# Altium project SmartHaloV1.PrjPcb (part 2 of 2)

## Sheet 5_SENSORS.SchDoc: SmartHalo V1.0 Rev1 - Sensors
size B; Author: Sébastien Gélinas; Organization: CycleLabs Solutions Inc.; Address1: 5445 de Gaspé; Address2: Montréal, QC; Address3: Canada; Address4: H2T 3B2; DocumentNumber: 2; Revision: 1; SheetNumber: 5; SheetTotal: 8
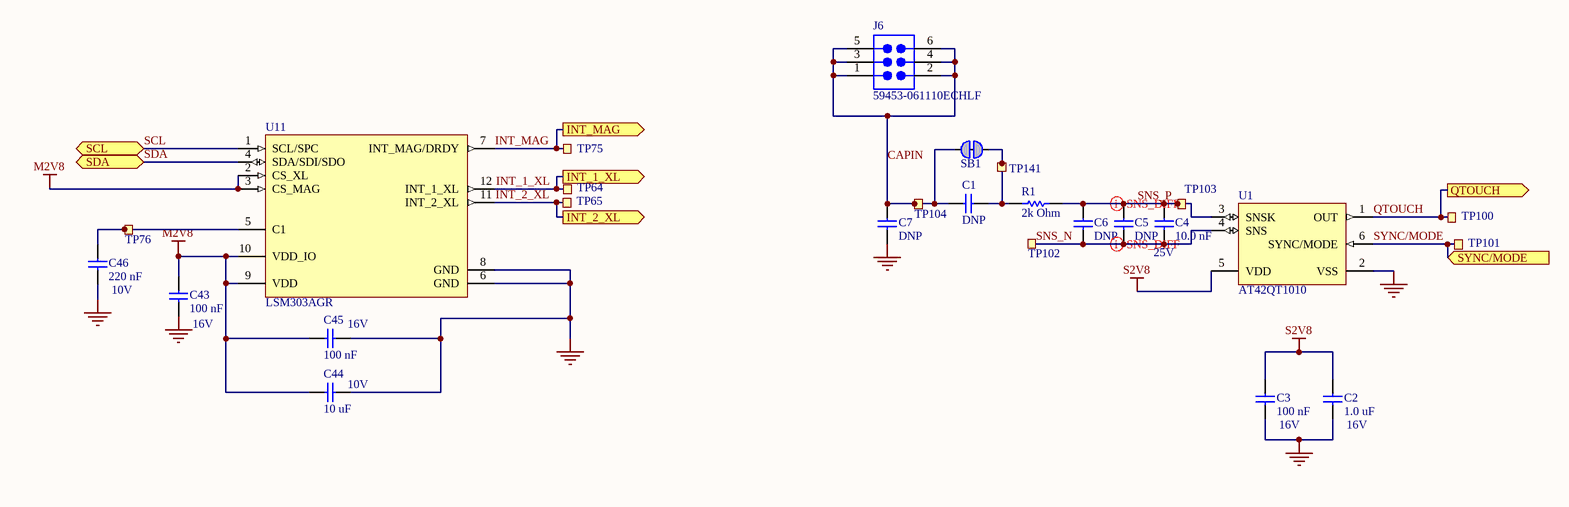
[diagram p4: 5_SENSORS.SchDoc]

### Parts
C1  DNP  [Varitron_CAP0402]  (no BOM)
C2  1.0 uF  Voltage Rating: 16V  [Varitron_CAP0603]
C3  100 nF  Voltage Rating: 16V  [Varitron_CAP0402]
C4  10.0 nF  Voltage Rating: 25V  [Varitron_CAP0402]
C5  DNP  [Varitron_CAP0402]  (no BOM)
C6  DNP  [Varitron_CAP0402]  (no BOM)
C7  DNP  [Varitron_CAP0402]  (no BOM)
C43  100 nF  Voltage Rating: 16V  [Varitron_CAP0402]
C44  10 uF  Voltage Rating: 10V  [Varitron_CAP0805]
C45  100 nF  Voltage Rating: 16V  [Varitron_CAP0402]
C46  220 nF  Voltage Rating: 10V  [Varitron_CAP0402]
J6  59453-061110ECHLF  [59453061110ECHLF]
R1  2k Ohm  [Varitron_RES0402]
SB1  Solderbridge  [Solderbridge_Shorted]  (value not drawn)  (net tie, no BOM)
TP64  TP64  [TESTPAD-TH-35mils]  (value not drawn)  (no BOM)
TP65  TP65  [TESTPAD-TH-35mils]  (value not drawn)  (no BOM)
TP75  TP75  [TESTPAD-TH-35mils]  (value not drawn)  (no BOM)
TP76  TP76  [TESTPAD-TH-35mils]  (value not drawn)  (no BOM)
TP100  TP100  [TESTPAD-TH-1_5mm]  (value not drawn)  (no BOM)
TP101  TP101  [TESTPAD-TH-35mils]  (value not drawn)  (no BOM)
TP102  TP102  [TESTPAD-TH-35mils]  (value not drawn)  (no BOM)
TP103  TP103  [TESTPAD-TH-35mils]  (value not drawn)  (no BOM)
TP104  TP104  [TESTPAD-TH-35mils]  (value not drawn)  (no BOM)
TP141  TP141  [TESTPAD-TH-35mils]  (value not drawn)  (no BOM)
U1  AT42QT1010  [6ST1_N]
U11  LSM303AGR  [LGA12-2X2X1_N]

### Ports
INT_1_XL (out), INT_2_XL (out), INT_MAG (out), QTOUCH (out), SCL (bidir), SDA (bidir), SYNC/MODE (in)

### Nets
GND: C2.2 C3.2 C7.2 C43.2 C44.2 C45.2 C46.2 J6.0(ASSY) U1.2(VSS) U11.6(GND) U11.8(GND)
M2V8: C43.1 C44.1 C45.1 U11.2(CS_XL) U11.3(CS_MAG) U11.9(VDD) U11.10(VDD_IO)  [project net VDD_nRF]
S2V8: C2.1 C3.1 U1.5(VDD)
CAPIN: C1.1 C7.1 J6.1 J6.2 J6.3 J6.4 J6.5 J6.6 SB1.2 TP104.1
INT_1_XL: TP64.1 U11.12(INT_1_XL) ; port INT_1_XL
INT_2_XL: TP65.1 U11.11(INT_2_XL) ; port INT_2_XL
INT_MAG: TP75.1 U11.7(INT_MAG/DRDY) ; port INT_MAG
QTOUCH: TP100.1 U1.1(OUT) ; port QTOUCH
SCL: U11.1(SCL/SPC) ; port SCL
SDA: U11.4(SDA/SDI/SDO) ; port SDA
SNS_N: C4.2 C5.2 C6.2 TP102.1 U1.4(SNS)
SNS_P: C4.1 C5.1 C6.1 R1.1 TP103.1 U1.3(SNSK)
SYNC/MODE: TP101.1 U1.6(SYNC/MODE) ; port SYNC/MODE
NetC1_2: C1.2 R1.2 SB1.1 TP141.1
NetC46_1: C46.1 TP76.1 U11.5(C1)

### Layout directives
differential pair: SNS_N, SNS_P

### Notes on the sheet
- Title
- Size:
- Date:
- B
- Author:
- Time:
- Sheet
- Revision:
- of
- File:

### Library data of the parts
C1 C5-C7 = Varitron_CAP0402: C nF V TEMP TOL% 0402 (1005 Metric)  SMD; Case-EIA: 0402; Case-Metric: 1005; Tolerance: TOL; Value: C nF; Final: Y; Technology: SMT; Footprint Name: 0402; Supplier: Arrow Electronics
C2 = Varitron_CAP0603: as C50 on sheet 2_PWR; Tolerance: 10%; Technology: SMT; Temperature Coefficient: X7R; Part Number: CL10B105KO8NNNC; Value: 1.0 uF; Supplier: Arrow Electronics; Footprint Name: 0603
C3 C43 C45 = Varitron_CAP0402: as C51 on sheet 2_PWR; Tolerance: 10%; Technology: SMT; Temperature Coefficient: X7R; Part Number: CL05B104KO5NNNC; Value: 100 nF; Supplier: Arrow Electronics; Footprint Name: 0402
C4 = Varitron_CAP0402: 10.0 nF 25V X7R 5% 0402 (1005 Metric)  SMD; Manufacturer: Yageo; Manufacturer Part Number: CC0402JRX7R8BB103; SmartHalo Part Number: 630004-01; Case-EIA: 0402; Case-Metric: 1005; Final: Y; Tolerance: 5%; Technology: SMT; Temperature Coefficient: X7R; Part Number: CC0402JRX7R8BB103; Value: 10.0 nF; Footprint Name: 0402; Supplier: Arrow Electronics
C44 = Varitron_CAP0805: 10 uF 10V X7R 10% 0805 (2012 Metric)  SMD; Manufacturer: Samsung; Manufacturer Part Number: CL21B106KPQNNNE; SmartHalo Part Number: 630013-01; Case-EIA: 0805; Case-Metric: 2012; Final: Y; Tolerance: 10%; Technology: SMT; Temperature Coefficient: X7R; Part Number: CL21B106KPQNNNE; Value: 10 uF; Supplier: Arrow Electronics; Footprint Name: 0805
C46 = Varitron_CAP0402: 220 nF 10V X7R 10% 0402 (1005 Metric)  SMD; Manufacturer: Samsung; Manufacturer Part Number: CL05B224KP5NNNC; SmartHalo Part Number: 630014-01; Case-EIA: 0402; Case-Metric: 1005; Final: Y; Tolerance: 10%; Technology: SMT; Temperature Coefficient: X7R; Part Number: CL05B224KP5NNNC; Value: 220 nF; Supplier: Arrow Electronics; Footprint Name: 0402
J6 = 59453-061110ECHLF: Connector, FPC, 0.5 mm pitch, 6 contacts; Manufacturer: FCI; SmartHalo Part Number: 630023-01; Final: Y; Manufacturer Part Number: 59453-061110ECHLF; Part Number: 59453-061110ECHLF; Footprint Name: CUSTOM(FPC Connector); Supplier: Arrow Electronics
R1 = Varitron_RES0402: 2k 0.063W 5%  0402 (1005 Metric)  SMD; Manufacturer: Samsung; Manufacturer Part Number: RC1005J202CS; SmartHalo Part Number: 630033-01; Case-Metric: 1005; Case-EIA: 0402; Final: Y; Tolerance: 5%; Technology: SMT; Power: 0.063W; Part Number: RC1005J202CS; Value: 2k Ohm; Footprint Name: 0402; Supplier: Arrow Electronics
SB1 = SOLDERBRIDGE_SHORTED: Shorted Solderbridge; Value: Solderbridge
TP64 TP65 TP75 TP76 TP101-TP104 TP141 = TESTPAD_TH_35mils: as TP1 on sheet 2_PWR
TP100 = TESTPAD_TH_1_5MM: as TP2 on sheet 2_PWR
U1 = AT42QT1010: One-channel Touch Sensor IC with Reset Timer, -40° to +85° C, 6-pin SOT23; Manufacturer: Atmel; SmartHalo Part Number: 630051-01; Final: Y; Manufacturer Part Number: AT42QT1010; Part Number: AT42QT1010; Footprint Name: SOT23-6; Supplier: Arrow Electronics
U11 = LSM303AGR: IC 3D Accelerometer and 3D Magnetometer, LGA-12, 2 x 2 x 1 mm; Manufacturer: STMicroelectronics; SmartHalo Part Number: 630059-01; Final: Y; Manufacturer Part Number: LSM303AGR; Footprint Name: LGA12; Part Number: LSM303AGR; Supplier: Arrow Electronics

## Sheet 6_MISC.SchDoc: SmartHalo V1.0 Rev1 - Misc
size B; Author: Sébastien Gélinas; Organization: CycleLabs Solutions Inc.; Address1: 5445 de Gaspé; Address2: Montréal, QC; Address3: Canada; Address4: H2T 3B2; Revision: 1; SheetNumber: 6; SheetTotal: 8
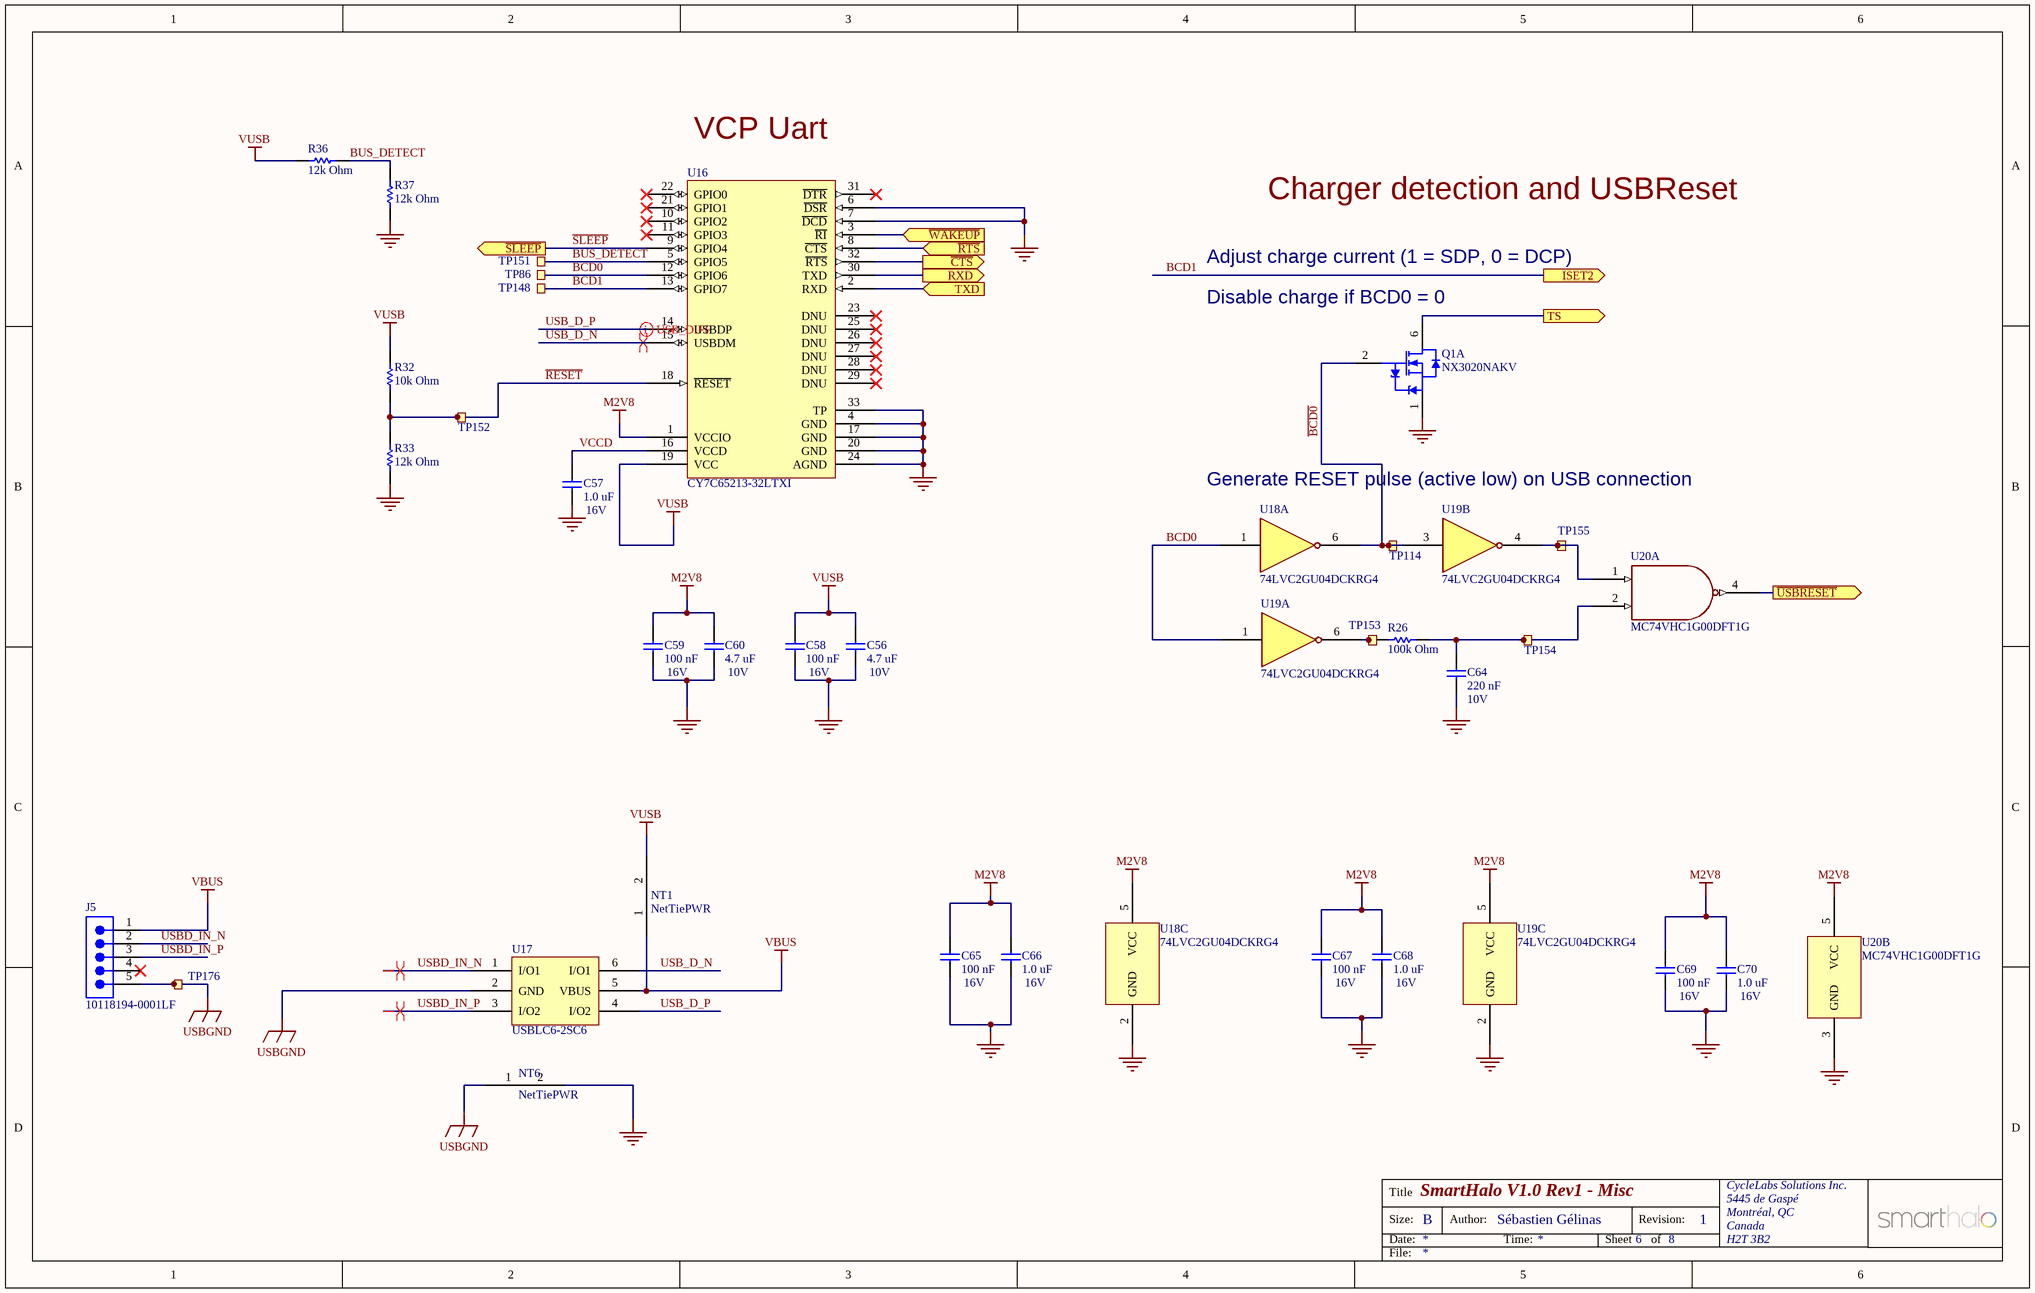
[diagram p5: 6_MISC.SchDoc]

### Parts
C56  4.7 uF  Voltage Rating: 10V  [Varitron_CAP0603]
C57  1.0 uF  Voltage Rating: 16V  [Varitron_CAP0603]
C58  100 nF  Voltage Rating: 16V  [Varitron_CAP0402]
C59  100 nF  Voltage Rating: 16V  [Varitron_CAP0402]
C60  4.7 uF  Voltage Rating: 10V  [Varitron_CAP0603]
C64  220 nF  Voltage Rating: 10V  [Varitron_CAP0402]
C65  100 nF  Voltage Rating: 16V  [Varitron_CAP0402]
C66  1.0 uF  Voltage Rating: 16V  [Varitron_CAP0603]
C67  100 nF  Voltage Rating: 16V  [Varitron_CAP0402]
C68  1.0 uF  Voltage Rating: 16V  [Varitron_CAP0603]
C69  100 nF  Voltage Rating: 16V  [Varitron_CAP0402]
C70  1.0 uF  Voltage Rating: 16V  [Varitron_CAP0603]
J5  10118194-0001LF  [10118194-0001LF]
NT1  NetTiePWR  [NetTiePWR]  (net tie, no BOM)
NT6  NetTiePWR  [NetTiePWR]  (net tie, no BOM)
Q1  NX3020NAKV  [SOT666]  (part A of 2)
R26  100k Ohm  [Varitron_RES0402]
R32  10k Ohm  [Varitron_RES0402]
R33  12k Ohm  [Varitron_RES0402]
R36  12k Ohm  [Varitron_RES0402]
R37  12k Ohm  [Varitron_RES0402]
TP86  TP86  [TESTPAD-TH-35mils]  (value not drawn)  (no BOM)
TP114  TP114  [TESTPAD-TH-35mils]  (value not drawn)  (no BOM)
TP148  TP148  [TESTPAD-TH-35mils]  (value not drawn)  (no BOM)
TP151  TP151  [TESTPAD-TH-35mils]  (value not drawn)  (no BOM)
TP152  TP152  [TESTPAD-TH-35mils]  (value not drawn)  (no BOM)
TP153  TP153  [TESTPAD-TH-35mils]  (value not drawn)  (no BOM)
TP154  TP154  [TESTPAD-TH-35mils]  (value not drawn)  (no BOM)
TP155  TP155  [TESTPAD-TH-35mils]  (value not drawn)  (no BOM)
TP176  TP176  [TESTPAD-TH-35mils]  (value not drawn)  (no BOM)
U16  CY7C65213-32LTXI  [QFN-32-TP]
U17  USBLC6-2SC6  [ST-SOT23-6]
U18  74LVC2GU04DCKRG4  [SOT363_SC70_6]  (parts A,C of 3)
U19  74LVC2GU04DCKRG4  [SOT363_SC70_6]  (parts A,B,C of 3)
U20  MC74VHC1G00DFT1G  [SC70-5]  (parts A,B of 2)

### Ports
ISET2 (out), RXD (out), TS (out), TXD (in), ~{CTS} (out), ~{RTS} (in), ~{SLEEP} (out), ~{USBRESET} (out), ~{WAKEUP} (in)

### Nets
GND: C56.2 C57.2 C58.2 C59.2 C60.2 C64.1 C65.2 C66.2 C67.2 C68.2 C69.2 C70.2 NT6.2(NET2) Q1.1(S1) R33.1 R37.2 U16.4(GND) U16.6(~{DSR}) U16.7(~{DCD}) U16.17(GND) U16.20(GND) U16.24(AGND) U16.33(TP) U18.2(GND) U19.2(GND) U20.3(GND)
M2V8: C59.1 C60.1 C65.1 C66.1 C67.1 C68.1 C69.1 C70.1 U16.1(VCCIO) U18.5(VCC) U19.5(VCC) U20.5(VCC)  [project net VDD_nRF]
USBGND: J5.0(ASSY) J5.5 NT6.1(NET1) TP176.1 U17.2(GND)
VBUS: J5.1 NT1.1(NET1) U17.5(VBUS)
VUSB: C56.1 C58.1 NT1.2(NET2) R32.2 R36.2 U16.19(VCC)
~{BCD0}: Q1.2(G1) TP114.1 U18.6 U19.3
BCD0: TP86.1 U16.12(GPIO6) U18.1 U19.1
BCD1: TP148.1 U16.13(GPIO7) ; port ISET2
BUS_DETECT: R36.1 R37.1 TP151.1 U16.5(GPIO5)
CTS: U16.32(~{RTS}) ; port ~{CTS}
~{RESET}: R32.1 R33.2 TP152.1 U16.18(~{RESET})
RTS: U16.8(~{CTS}) ; port ~{RTS}
RXD: U16.30(TXD) ; port RXD
~{SLEEP}: U16.9(GPIO4) ; port ~{SLEEP}
TS: Q1.6(D1) ; port TS
TXD: U16.2(RXD) ; port TXD
~{USBRESET}: U20.4 ; port ~{USBRESET}
USB_D_N: U16.15(USBDM) U17.6(I/O1)
USB_D_P: U16.14(USBDP) U17.4(I/O2)
USBD_IN_N: J5.2 U17.1(I/O1)
USBD_IN_P: J5.3 U17.3(I/O2)
VCCD: C57.1 U16.16(VCCD)
~{WAKEUP}: U16.3(~{RI}) ; port ~{WAKEUP}
NetC64_2: C64.2 R26.1 TP154.1 U20.2
NetR26_2: R26.2 TP153.1 U19.6
NetTP155_1: TP155.1 U19.4 U20.1

Not connected (* = marked no-connect by the designer): J5 4*; U16 10(GPIO2)* 11(GPIO3)* 21(GPIO1)* 22(GPIO0)* 23(DNU)* 25(DNU)* 26(DNU)* 27(DNU)* 28(DNU)* 29(DNU)* 31(~{DTR})*

### Layout directives
differential pair: USB_D_N, USB_D_P, USBD_IN_N, USBD_IN_P

### Notes on the sheet
- (near U16) VCP Uart
- Charger detection and USBReset
- Adjust charge current (1 = SDP, 0 = DCP)
- (near Q1) Disable charge if BCD0 = 0
- Generate RESET pulse (active low) on USB connection
- Title
- Size:
- Date:
- B
- Author:
- Time:
- Sheet
- Revision:
- of
- File:

### Library data of the parts
C56 C60 = Varitron_CAP0603: 4.7 uF 10V X5R 10% 0603 (1608 Metric)  SMD; Manufacturer: Yageo; Manufacturer Part Number: CC0603KRX5R6BB475; SmartHalo Part Number: 630009-01; Case-EIA: 0603; Case-Metric: 1608; Final: Y; Tolerance: 10%; Technology: SMT; Temperature Coefficient: X5R; Part Number: CC0603KRX5R6BB475; Value: 4.7 uF; Supplier: Arrow Electronics; Footprint Name: 0603
C57 C66 C68 C70 = Varitron_CAP0603: as C50 on sheet 2_PWR; Tolerance: 10%; Technology: SMT; Temperature Coefficient: X7R; Part Number: CL10B105KO8NNNC; Value: 1.0 uF; Supplier: Arrow Electronics; Footprint Name: 0603
C58 C59 C65 C67 C69 = Varitron_CAP0402: as C51 on sheet 2_PWR; Tolerance: 10%; Technology: SMT; Temperature Coefficient: X7R; Part Number: CL05B104KO5NNNC; Value: 100 nF; Supplier: Arrow Electronics; Footprint Name: 0402
C64 = Varitron_CAP0402: as C46 on sheet 5_SENSORS; Tolerance: 10%; Technology: SMT; Temperature Coefficient: X7R; Part Number: CL05B224KP5NNNC; Supplier: Arrow Electronics; Footprint Name: 0402; Value: 220 nF
J5 = 10118194-0001LF: Micro USB B Type Receptacle; Manufacturer: Amphenol FCI; SmartHalo Part Number: 630022-01; Final: Y; Manufacturer Part Number: 10118194-0001LF; Part Number: 10118194-0001LF; Footprint Name: CUSTOM(Micro USB connector); Supplier: Arrow Electronics; Supplier Part Number: *
Q1 = NX3020NAKV: 30 V, 200 mA dual N-channel Trench MOSFET; Manufacturer: NXP Semiconductors; SmartHalo Part Number: 630030-01; Final: Y; Manufacturer Part Number: NX3020NAKV; Part Number: NX3020NAKV; Footprint Name: SOT666; Supplier: Arrow Electronics
R26 = Varitron_RES0402: 100k 0.063W 5%  0402 (1005 Metric)  SMD; Manufacturer: Samsung; Manufacturer Part Number: RC1005J104CS; SmartHalo Part Number: 630036-01; Case-Metric: 1005; Case-EIA: 0402; Final: Y; Tolerance: 5%; Technology: SMT; Power: 0.063W; Part Number: RC1005J104CS; Supplier: Arrow Electronics; Footprint Name: 0402; Value: 100k Ohm
R32 = Varitron_RES0402: as R19 on sheet 2_PWR; Tolerance: 5%; Technology: SMT; Power: 0.063W; Part Number: RC1005J103CS; Value: 10k Ohm; Footprint Name: 0402; Supplier: Arrow Electronics
R33 R36 R37 = Varitron_RES0402: 12k 0.063W 5%  0402 (1005 Metric)  SMD; Manufacturer: Samsung; Manufacturer Part Number: RC1005J123CS; SmartHalo Part Number: 630047-01; Case-Metric: 1005; Case-EIA: 0402; Final: Y; Tolerance: 5%; Technology: SMT; Power: 0.063W; Part Number: RC1005J123CS; Value: 12k Ohm; Footprint Name: 0402; Supplier: Arrow Electronics
TP86 TP114 TP148 TP151-TP155 TP176 = TESTPAD_TH_35mils: as TP1 on sheet 2_PWR
U16 = CY7C65213-32LTXI: IC USB TO UART BRIDGE 32QFN; Manufacturer: Cypress; SmartHalo Part Number: 630063-01; Final: Y; Manufacturer Part Number: CY7C65213-32LTXI; Part Number: CY7C65213-32LTXI; Footprint Name: QFN32TP; Supplier: Arrow Electronics
U17 = USBLC6-2SC6: Very low capacitance ESD protection; Manufacturer: STMicroelectronics; SmartHalo Part Number: 630064-01; Manufacturer Part Number: USBLC6-2SC6; Part Number: USBLC6-2SC6; Supplier: Arrow Electronics; Footprint Name: SOT23-6
U18 U19 = 74LVC2GU04DCKRG4: Dual Inverter Gate; Manufacturer: Texas Instruments; SmartHalo Part Number: 630057-01; Final: Y; Manufacturer Part Number: 74LVC2GU04DCKRG4; Part Number: 74LVC2GU04DCKRG4; Supplier: Arrow Electronics; Footprint Name: SOT363
U20 = MC74VHC1G00DFT1G: IC Gate NAND 1 Channel; Manufacturer: ON Semiconductor; SmartHalo Part Number: 630065-01; Final: Y; Part Number: MC74VHC1G00DFT1G; Manufacturer Part Number: MC74VHC1G00DFT1G; Supplier: Arrow Electronics; Footprint Name: SC-70

## Sheet 7_ALARM.SchDoc: SmartHalo V1.0 Rev1 - Alarm (sound)
size B; Author: Sebastien Gelinas; CompanyName: CycleLabs Solutions Inc.; Organization: CycleLabs Solutions Inc.; Address1: 5445 de Gaspé; Address2: Montréal, QC; Address3: Canada; Address4: H2T 3B2; Revision: 1; SheetNumber: 7; SheetTotal: 8
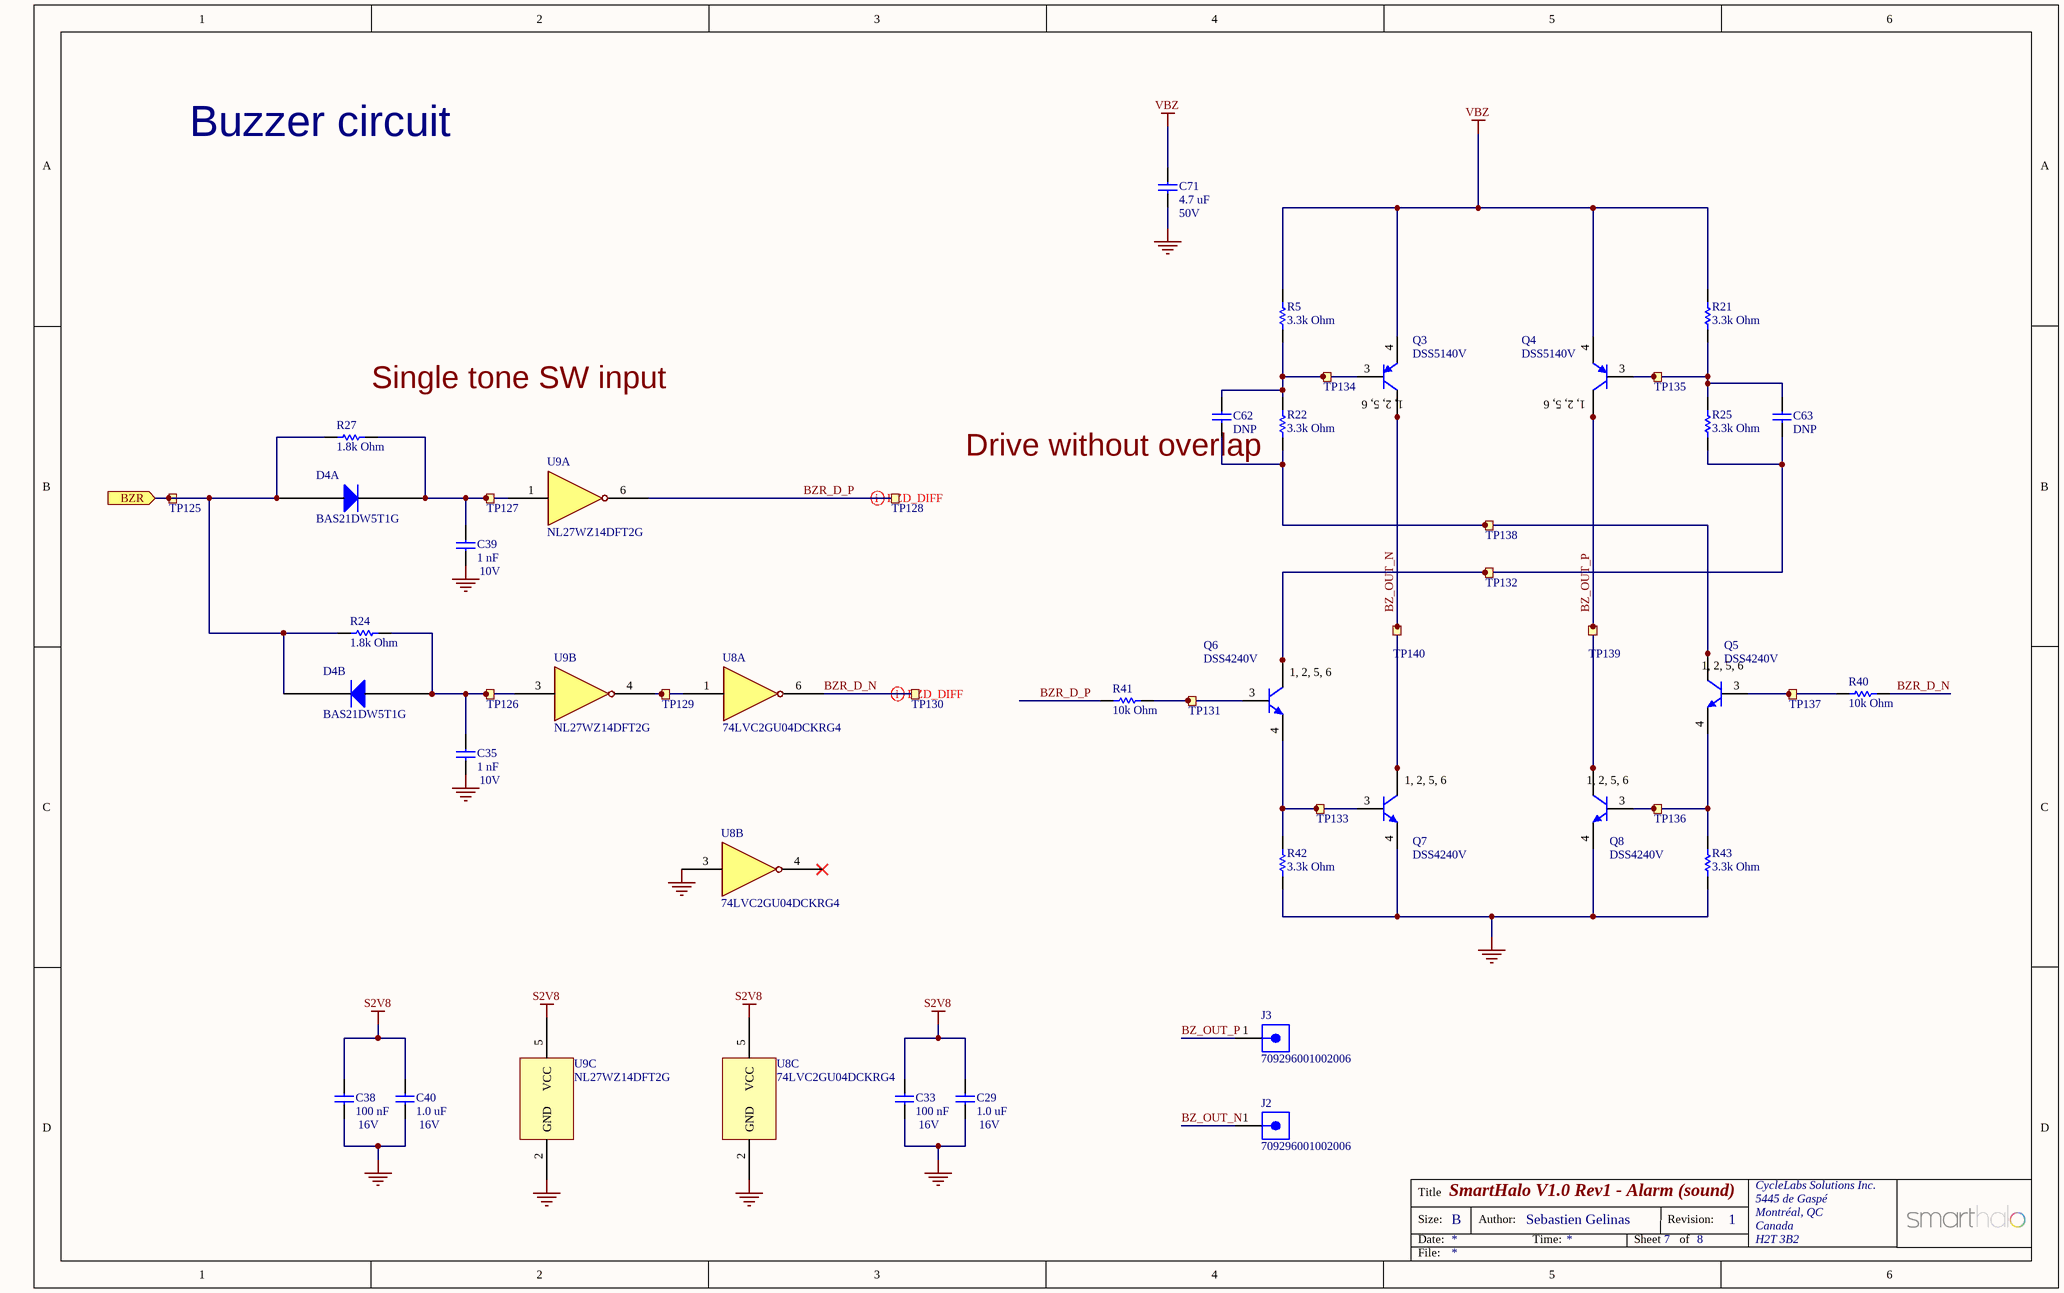
[diagram p6: 7_ALARM.SchDoc]

### Parts
C29  1.0 uF  Voltage Rating: 16V  [Varitron_CAP0603]
C33  100 nF  Voltage Rating: 16V  [Varitron_CAP0402]
C35  1 nF  Voltage Rating: 10V  [Varitron_CAP0402]
C38  100 nF  Voltage Rating: 16V  [Varitron_CAP0402]
C39  1 nF  Voltage Rating: 10V  [Varitron_CAP0402]
C40  1.0 uF  Voltage Rating: 16V  [Varitron_CAP0603]
C62  DNP  [Varitron_CAP0402]  (no BOM)
C63  DNP  [Varitron_CAP0402]  (no BOM)
C71  4.7 uF  Voltage Rating: 50V  [Varitron_CAP0805]
D4  BAS21DW5T1G  [SC70-5]  (parts A,B of 2)
J2  709296001002006  [709296001002006]
J3  709296001002006  [709296001002006]
Q3  DSS5140V  [SOT563]
Q4  DSS5140V  [SOT563]
Q5  DSS4240V  [SOT563]
Q6  DSS4240V  [SOT563]
Q7  DSS4240V  [SOT563]
Q8  DSS4240V  [SOT563]
R5  3.3k Ohm  [Varitron_RES0402]
R21  3.3k Ohm  [Varitron_RES0402]
R22  3.3k Ohm  [Varitron_RES0402]
R24  1.8k Ohm  [Varitron_RES0402]
R25  3.3k Ohm  [Varitron_RES0402]
R27  1.8k Ohm  [Varitron_RES0402]
R40  10k Ohm  [Varitron_RES0402]
R41  10k Ohm  [Varitron_RES0402]
R42  3.3k Ohm  [Varitron_RES0402]
R43  3.3k Ohm  [Varitron_RES0402]
TP125  TP125  [TESTPAD-TH-1_5mm]  (value not drawn)  (no BOM)
TP126  TP126  [TESTPAD-TH-35mils]  (value not drawn)  (no BOM)
TP127  TP127  [TESTPAD-TH-35mils]  (value not drawn)  (no BOM)
TP128  TP128  [TESTPAD-TH-35mils]  (value not drawn)  (no BOM)
TP129  TP129  [TESTPAD-TH-35mils]  (value not drawn)  (no BOM)
TP130  TP130  [TESTPAD-TH-35mils]  (value not drawn)  (no BOM)
TP131  TP131  [TESTPAD-TH-35mils]  (value not drawn)  (no BOM)
TP132  TP132  [TESTPAD-TH-35mils]  (value not drawn)  (no BOM)
TP133  TP133  [TESTPAD-TH-35mils]  (value not drawn)  (no BOM)
TP134  TP134  [TESTPAD-TH-35mils]  (value not drawn)  (no BOM)
TP135  TP135  [TESTPAD-TH-35mils]  (value not drawn)  (no BOM)
TP136  TP136  [TESTPAD-TH-35mils]  (value not drawn)  (no BOM)
TP137  TP137  [TESTPAD-TH-35mils]  (value not drawn)  (no BOM)
TP138  TP138  [TESTPAD-TH-35mils]  (value not drawn)  (no BOM)
TP139  TP139  [TESTPAD-TH-1_5mm]  (value not drawn)  (no BOM)
TP140  TP140  [TESTPAD-TH-1_5mm]  (value not drawn)  (no BOM)
U8  74LVC2GU04DCKRG4  [SOT363_SC70_6]  (parts A,B,C of 3)
U9  NL27WZ14DFT2G  [SOT363_SC70_6]  (parts A,B,C of 3)

### Ports
BZR (in)

### Nets
GND: C29.2 C33.2 C35.2 C38.2 C39.2 C40.2 C71.2 Q7.4(E) Q8.4(E) R42.2 R43.1 U8.2(GND) U8.3 U9.2(GND)
S2V8: C29.1 C33.1 C38.1 C40.1 U8.5(VCC) U9.5(VCC)
VBZ: C71.1 Q3.4(E) Q4.4(E) R5.2 R21.2
BZ_OUT_N: J2.1 Q3.1(C) Q3.2(C) Q3.5(C) Q3.6(C) Q7.1(C) Q7.2(C) Q7.5(C) Q7.6(C) TP140.1
BZ_OUT_P: J3.1 Q4.1(C) Q4.2(C) Q4.5(C) Q4.6(C) Q8.1(C) Q8.2(C) Q8.5(C) Q8.6(C) TP139.1
BZR: D4.1(Anode) D4.4(Cathode) R24.2 R27.2 TP125.1 ; port BZR
BZR_D_N: R40.2 TP130.1 U8.6
BZR_D_P: R41.2 TP128.1 U9.6
NetC35_1: C35.1 D4.3(Anode) R24.1 TP126.1 U9.3
NetC39_1: C39.1 D4.5(Cathode) R27.1 TP127.1 U9.1
NetC62_1: C62.1 Q5.1(C) Q5.2(C) Q5.5(C) Q5.6(C) R22.1 TP138.1
NetC62_2: C62.2 Q3.3(B) R5.1 R22.2 TP134.1
NetC63_1: C63.1 Q6.1(C) Q6.2(C) Q6.5(C) Q6.6(C) R25.1 TP132.1
NetC63_2: C63.2 Q4.3(B) R21.1 R25.2 TP135.1
NetQ5_3: Q5.3(B) R40.1 TP137.1
NetQ5_4: Q5.4(E) Q8.3(B) R43.2 TP136.1
NetQ6_3: Q6.3(B) R41.1 TP131.1
NetQ6_4: Q6.4(E) Q7.3(B) R42.1 TP133.1
NetTP129_1: TP129.1 U8.1 U9.4

Not connected (* = marked no-connect by the designer): D4 2; U8 4*

### Layout directives
differential pair: BZR_D_N, BZR_D_P

### Notes on the sheet
- Buzzer circuit
- (near R27) Single tone SW input
- Drive without overlap
- Title
- Size:
- Date:
- B
- Author:
- Time:
- Sheet
- Revision:
- of
- File:
- (in symbol DSS4240V) 1, 2, 5, 6
- (in symbol DSS5140V) 1, 2, 5, 6

### Library data of the parts
C29 C40 = Varitron_CAP0603: 1.0 uF 16V X7R 10% 0603 (1608 Metric)  SMD; Manufacturer: Samsung; Manufacturer Part Number: CL10B105KO8NNNC; SmartHalo Part Number: 630002-01; Case-EIA: 0603; Case-Metric: 1608; Final: Y; Tolerance: 10%; Technology: SMT; Temperature Coefficient: X7R; Part Number: CL10B105KO8NNNC; Value: 1.0 uF; Supplier: Arrow Electronics; Footprint Name: 0603
C33 C38 = Varitron_CAP0402: 100 nF 16V X7R 10% 0402 (1005 Metric)  SMD; Manufacturer: Samsung; Manufacturer Part Number: CL05B104KO5NNNC; SmartHalo Part Number: 630003-01; Case-EIA: 0402; Case-Metric: 1005; Final: Y; Tolerance: 10%; Technology: SMT; Temperature Coefficient: X7R; Part Number: CL05B104KO5NNNC; Value: 100 nF; Supplier: Arrow Electronics; Footprint Name: 0402
C35 C39 = Varitron_CAP0402: 1 nF 10V X7R 10% 0402 (1005 Metric)  SMD; Manufacturer: AVX; Manufacturer Part Number: 0402ZC102KAT2A; SmartHalo Part Number: 630012-01; Case-EIA: 0402; Case-Metric: 1005; Final: Y; Tolerance: 10%; Technology: SMT; Temperature Coefficient: X7R; Part Number: 0402ZC102KAT2A; Value: 1 nF; Supplier: Arrow Electronics; Footprint Name: 0402
C62 C63 = Varitron_CAP0402: 220 pF 50V X7R 10% 0402 (1005 Metric)  SMD; Case-EIA: 0402; Case-Metric: 1005; Final: Y; Value: 220 pF; Tolerance: 10%; Technology: SMT; Temperature Coefficient: X7R; Supplier: Arrow Electronics; Footprint Name: 0402; Voltage Rating: 50V
C71 = Varitron_CAP0805: 4.7 uF 50V X5R 10% 0805 (2012 Metric)  SMD; Manufacturer: Samsung; Manufacturer Part Number: CL21A475KBQNNNE; SmartHalo Part Number: 630010-01; Case-EIA: 0805; Case-Metric: 2012; Final: Y; Tolerance: 10%; Technology: SMT; Temperature Coefficient: X5R; Part Number: CL21A475KBQNNNE; Supplier: Arrow Electronics; Footprint Name: 0805; Value: 4.7 uF
D4 = BAS21DW5T1G: High Voltage Switching Diode; Manufacturer: ON Semiconductor; SmartHalo Part Number: 630018-01; Final: Y; Manufacturer Part Number: BAS21DW5T1G; Part Number: BAS21DW5T1G; Footprint Name: SC70-5; Supplier: Arrow Electronics
J2 J3 = 709296001002006: Connector, Single Horizontal Contact, 2 x 2 mm; Manufacturer: AVX; SmartHalo Part Number: 630020-01; Final: Y; Manufacturer Part Number: 709296001002006; Part Number: 709296001002006; Footprint Name: CUSTOM(Wire to board connector); Supplier: Arrow Electronics; Supplier Part Number: *
Q3 Q4 = DSS5140V: PNP SMT Transistor, Low VCESAT; Manufacturer: Diodes Inc.; SmartHalo Part Number: 630031-01; Final: Y; hfe: 300; VBE: -1V; VCESAT: -310 mV; Supplier: Arrow Electronics; Part Number: DSS5140V; Manufacturer Part Number: DSS5140V; Footprint Name: SOT563
Q5-Q8 = DSS4240V: NPN SMT Transistor, Low VCESAT; Manufacturer: Diodes Inc.; SmartHalo Part Number: 630032-01; Final: Y; hfe: 300; VBE: 1.1V; VCESAT: 400 mV; Supplier: Arrow Electronics; Part Number: DSS4240V; Manufacturer Part Number: DSS4240V; Footprint Name: SOT563
R5 = Varitron_RES0402: 3k3 0.063W 5%  0402 (1005 Metric)  SMD; Manufacturer: Samsung; Manufacturer Part Number: RC1005J332CS; SmartHalo Part Number: 630037-01; Case-Metric: 1005; Power: 0.063; Case-EIA: 0402; Final: Y; Tolerance: 5%; Technology: SMT; Part Number: RC1005J332CS; Supplier: Arrow Electronics; Footprint Name: 0402; Value: 3.3k Ohm
R21 R22 R25 R42 R43 = Varitron_RES0402: 3k3 0.063W 5%  0402 (1005 Metric)  SMD; Manufacturer: Samsung; Manufacturer Part Number: RC1005J332CS; SmartHalo Part Number: 630037-01; Case-Metric: 1005; Case-EIA: 0402; Final: Y; Tolerance: 5%; Technology: SMT; Power: 0.063W; Part Number: RC1005J332CS; Supplier: Arrow Electronics; Footprint Name: 0402; Value: 3.3k Ohm
R24 R27 = Varitron_RES0402: 1k8 0.063W 5%  0402 (1005 Metric)  SMD; Manufacturer: Samsung; Manufacturer Part Number: RC1005J182CS; SmartHalo Part Number: 630046-01; Case-Metric: 1005; Case-EIA: 0402; Final: Y; Tolerance: 5%; Technology: SMT; Power: 0.063W; Part Number: RC1005J182CS; Value: 1.8k Ohm; Footprint Name: 0402; Supplier: Arrow Electronics
R40 R41 = Varitron_RES0402: 10k 0.063W 5%  0402 (1005 Metric)  SMD; Manufacturer: Samsung; Manufacturer Part Number: RC1005J103CS; SmartHalo Part Number: 630041-01; Case-Metric: 1005; Case-EIA: 0402; Final: Y; Tolerance: 5%; Technology: SMT; Power: 0.063W; Part Number: RC1005J103CS; Supplier: Arrow Electronics; Footprint Name: 0402; Value: 10k Ohm
TP125 TP139 TP140 = TESTPAD_TH_1_5MM: Testpoint, through hole, 1.5mm; Value: TP
TP126-TP138 = TESTPAD_TH_35mils: Testpoint, through hole, 35 mils; Value: TP
U8 = 74LVC2GU04DCKRG4: Dual Inverter Gate; Manufacturer: Texas Instruments; SmartHalo Part Number: 630057-01; Final: Y; Manufacturer Part Number: 74LVC2GU04DCKRG4; Part Number: 74LVC2GU04DCKRG4; Supplier: Arrow Electronics; Footprint Name: SOT363
U9 = NL27WZ14DFT2G: IC Dual Inverter with Schmitt Trigger Inputs; Manufacturer: ON Semiconductor; SmartHalo Part Number: 630058-01; Final: Y; Manufacturer Part Number: NL27WZ14DFT2G; Part Number: NL27WZ14DFT2G; Footprint Name: SOT363; Supplier: Arrow Electronics

## Sheet 8_LEDS.SchDoc: SmartHalo V1.0 Rev1 - Leds
size B; Author: Sébastien Gélinas; Organization: CycleLabs Solutions Inc.; Address1: 5445 de Gaspé; Address2: Montréal, QC; Address3: Canada; Address4: H2T 3B2; Revision: 1; SheetNumber: 8; SheetTotal: 8
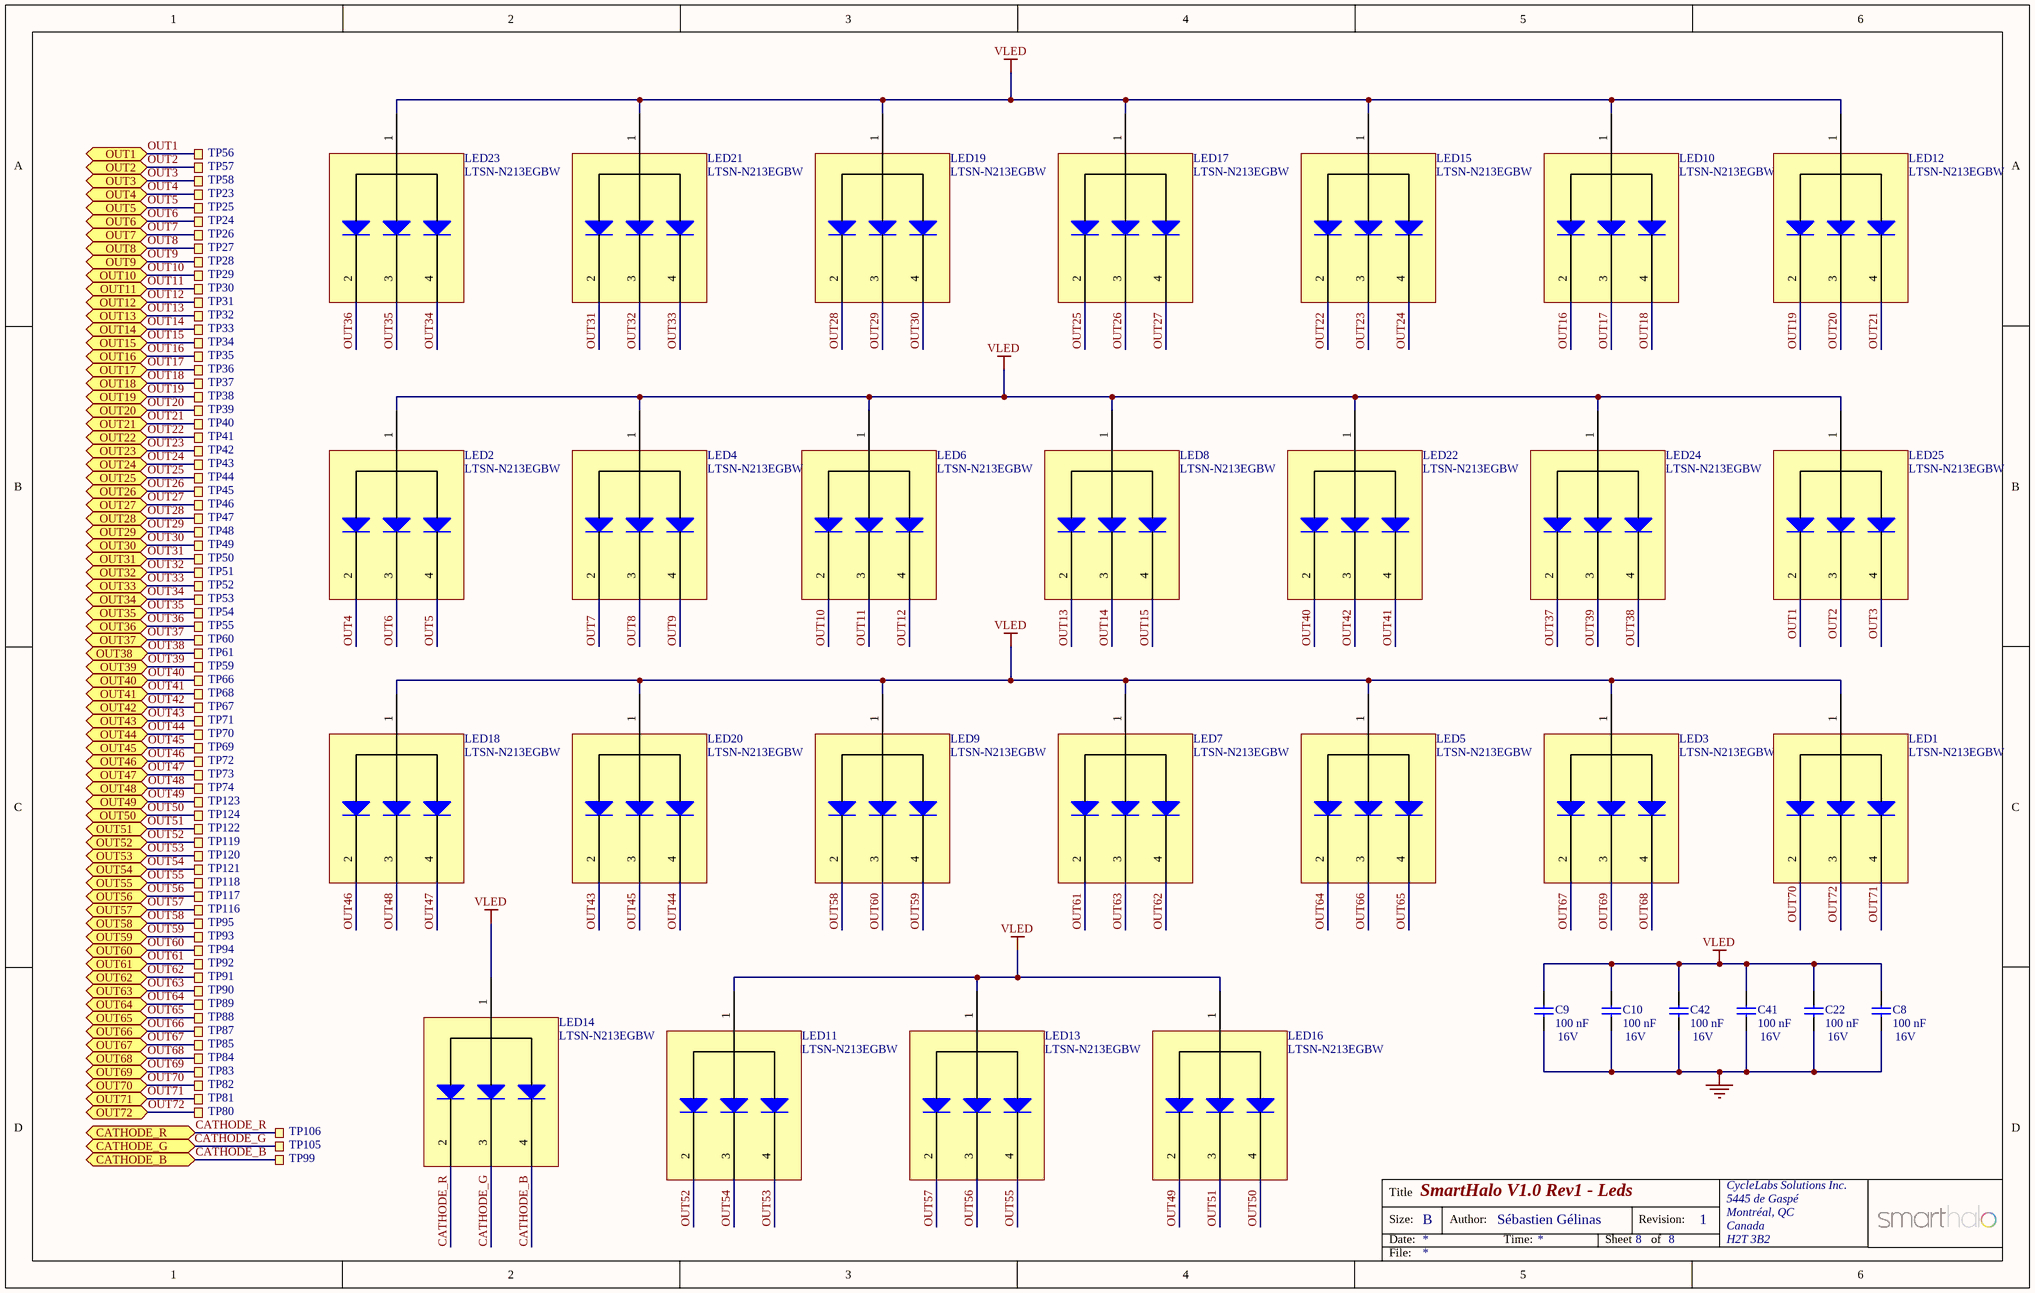
[diagram p7: 8_LEDS.SchDoc]

### Parts
C8  100 nF  Voltage Rating: 16V  [Varitron_CAP0402]
C9  100 nF  Voltage Rating: 16V  [Varitron_CAP0402]
C10  100 nF  Voltage Rating: 16V  [Varitron_CAP0402]
C22  100 nF  Voltage Rating: 16V  [Varitron_CAP0402]
C41  100 nF  Voltage Rating: 16V  [Varitron_CAP0402]
C42  100 nF  Voltage Rating: 16V  [Varitron_CAP0402]
LED1  LTSN-N213EGBW  [LTSN-N213EGBW]
LED2  LTSN-N213EGBW  [LTSN-N213EGBW]
LED3  LTSN-N213EGBW  [LTSN-N213EGBW]
LED4  LTSN-N213EGBW  [LTSN-N213EGBW]
LED5  LTSN-N213EGBW  [LTSN-N213EGBW]
LED6  LTSN-N213EGBW  [LTSN-N213EGBW]
LED7  LTSN-N213EGBW  [LTSN-N213EGBW]
LED8  LTSN-N213EGBW  [LTSN-N213EGBW]
LED9  LTSN-N213EGBW  [LTSN-N213EGBW]
LED10  LTSN-N213EGBW  [LTSN-N213EGBW]
LED11  LTSN-N213EGBW  [LTSN-N213EGBW]
LED12  LTSN-N213EGBW  [LTSN-N213EGBW]
LED13  LTSN-N213EGBW  [LTSN-N213EGBW]
LED14  LTSN-N213EGBW  [LTSN-N213EGBW]
LED15  LTSN-N213EGBW  [LTSN-N213EGBW]
LED16  LTSN-N213EGBW  [LTSN-N213EGBW]
LED17  LTSN-N213EGBW  [LTSN-N213EGBW]
LED18  LTSN-N213EGBW  [LTSN-N213EGBW]
LED19  LTSN-N213EGBW  [LTSN-N213EGBW]
LED20  LTSN-N213EGBW  [LTSN-N213EGBW]
LED21  LTSN-N213EGBW  [LTSN-N213EGBW]
LED22  LTSN-N213EGBW  [LTSN-N213EGBW]
LED23  LTSN-N213EGBW  [LTSN-N213EGBW]
LED24  LTSN-N213EGBW  [LTSN-N213EGBW]
LED25  LTSN-N213EGBW  [LTSN-N213EGBW]
TP23  TP23  [TESTPAD-TH-35mils]  (value not drawn)  (no BOM)
TP24  TP24  [TESTPAD-TH-35mils]  (value not drawn)  (no BOM)
TP25  TP25  [TESTPAD-TH-35mils]  (value not drawn)  (no BOM)
TP26  TP26  [TESTPAD-TH-35mils]  (value not drawn)  (no BOM)
TP27  TP27  [TESTPAD-TH-35mils]  (value not drawn)  (no BOM)
TP28  TP28  [TESTPAD-TH-35mils]  (value not drawn)  (no BOM)
TP29  TP29  [TESTPAD-TH-35mils]  (value not drawn)  (no BOM)
TP30  TP30  [TESTPAD-TH-35mils]  (value not drawn)  (no BOM)
TP31  TP31  [TESTPAD-TH-35mils]  (value not drawn)  (no BOM)
TP32  TP32  [TESTPAD-TH-35mils]  (value not drawn)  (no BOM)
TP33  TP33  [TESTPAD-TH-35mils]  (value not drawn)  (no BOM)
TP34  TP34  [TESTPAD-TH-35mils]  (value not drawn)  (no BOM)
TP35  TP35  [TESTPAD-TH-35mils]  (value not drawn)  (no BOM)
TP36  TP36  [TESTPAD-TH-35mils]  (value not drawn)  (no BOM)
TP37  TP37  [TESTPAD-TH-35mils]  (value not drawn)  (no BOM)
TP38  TP38  [TESTPAD-TH-35mils]  (value not drawn)  (no BOM)
TP39  TP39  [TESTPAD-TH-35mils]  (value not drawn)  (no BOM)
TP40  TP40  [TESTPAD-TH-35mils]  (value not drawn)  (no BOM)
TP41  TP41  [TESTPAD-TH-35mils]  (value not drawn)  (no BOM)
TP42  TP42  [TESTPAD-TH-35mils]  (value not drawn)  (no BOM)
TP43  TP43  [TESTPAD-TH-35mils]  (value not drawn)  (no BOM)
TP44  TP44  [TESTPAD-TH-35mils]  (value not drawn)  (no BOM)
TP45  TP45  [TESTPAD-TH-35mils]  (value not drawn)  (no BOM)
TP46  TP46  [TESTPAD-TH-35mils]  (value not drawn)  (no BOM)
TP47  TP47  [TESTPAD-TH-35mils]  (value not drawn)  (no BOM)
TP48  TP48  [TESTPAD-TH-35mils]  (value not drawn)  (no BOM)
TP49  TP49  [TESTPAD-TH-35mils]  (value not drawn)  (no BOM)
TP50  TP50  [TESTPAD-TH-35mils]  (value not drawn)  (no BOM)
TP51  TP51  [TESTPAD-TH-35mils]  (value not drawn)  (no BOM)
TP52  TP52  [TESTPAD-TH-35mils]  (value not drawn)  (no BOM)
TP53  TP53  [TESTPAD-TH-35mils]  (value not drawn)  (no BOM)
TP54  TP54  [TESTPAD-TH-35mils]  (value not drawn)  (no BOM)
TP55  TP55  [TESTPAD-TH-35mils]  (value not drawn)  (no BOM)
TP56  TP56  [TESTPAD-TH-35mils]  (value not drawn)  (no BOM)
TP57  TP57  [TESTPAD-TH-35mils]  (value not drawn)  (no BOM)
TP58  TP58  [TESTPAD-TH-35mils]  (value not drawn)  (no BOM)
TP59  TP59  [TESTPAD-TH-35mils]  (value not drawn)  (no BOM)
TP60  TP60  [TESTPAD-TH-35mils]  (value not drawn)  (no BOM)
TP61  TP61  [TESTPAD-TH-35mils]  (value not drawn)  (no BOM)
TP66  TP66  [TESTPAD-TH-35mils]  (value not drawn)  (no BOM)
TP67  TP67  [TESTPAD-TH-35mils]  (value not drawn)  (no BOM)
TP68  TP68  [TESTPAD-TH-35mils]  (value not drawn)  (no BOM)
TP69  TP69  [TESTPAD-TH-35mils]  (value not drawn)  (no BOM)
TP70  TP70  [TESTPAD-TH-35mils]  (value not drawn)  (no BOM)
TP71  TP71  [TESTPAD-TH-35mils]  (value not drawn)  (no BOM)
TP72  TP72  [TESTPAD-TH-35mils]  (value not drawn)  (no BOM)
TP73  TP73  [TESTPAD-TH-35mils]  (value not drawn)  (no BOM)
TP74  TP74  [TESTPAD-TH-35mils]  (value not drawn)  (no BOM)
TP80  TP80  [TESTPAD-TH-35mils]  (value not drawn)  (no BOM)
TP81  TP81  [TESTPAD-TH-35mils]  (value not drawn)  (no BOM)
TP82  TP82  [TESTPAD-TH-35mils]  (value not drawn)  (no BOM)
TP83  TP83  [TESTPAD-TH-35mils]  (value not drawn)  (no BOM)
TP84  TP84  [TESTPAD-TH-35mils]  (value not drawn)  (no BOM)
TP85  TP85  [TESTPAD-TH-35mils]  (value not drawn)  (no BOM)
TP87  TP87  [TESTPAD-TH-35mils]  (value not drawn)  (no BOM)
TP88  TP88  [TESTPAD-TH-35mils]  (value not drawn)  (no BOM)
TP89  TP89  [TESTPAD-TH-35mils]  (value not drawn)  (no BOM)
TP90  TP90  [TESTPAD-TH-35mils]  (value not drawn)  (no BOM)
TP91  TP91  [TESTPAD-TH-35mils]  (value not drawn)  (no BOM)
TP92  TP92  [TESTPAD-TH-35mils]  (value not drawn)  (no BOM)
TP93  TP93  [TESTPAD-TH-35mils]  (value not drawn)  (no BOM)
TP94  TP94  [TESTPAD-TH-35mils]  (value not drawn)  (no BOM)
TP95  TP95  [TESTPAD-TH-35mils]  (value not drawn)  (no BOM)
TP99  TP99  [TESTPAD-TH-35mils]  (value not drawn)  (no BOM)
TP105  TP105  [TESTPAD-TH-35mils]  (value not drawn)  (no BOM)
TP106  TP106  [TESTPAD-TH-35mils]  (value not drawn)  (no BOM)
TP116  TP116  [TESTPAD-TH-35mils]  (value not drawn)  (no BOM)
TP117  TP117  [TESTPAD-TH-35mils]  (value not drawn)  (no BOM)
TP118  TP118  [TESTPAD-TH-35mils]  (value not drawn)  (no BOM)
TP119  TP119  [TESTPAD-TH-35mils]  (value not drawn)  (no BOM)
TP120  TP120  [TESTPAD-TH-35mils]  (value not drawn)  (no BOM)
TP121  TP121  [TESTPAD-TH-35mils]  (value not drawn)  (no BOM)
TP122  TP122  [TESTPAD-TH-35mils]  (value not drawn)  (no BOM)
TP123  TP123  [TESTPAD-TH-35mils]  (value not drawn)  (no BOM)
TP124  TP124  [TESTPAD-TH-35mils]  (value not drawn)  (no BOM)

### Ports
CATHODE_B, CATHODE_G, CATHODE_R, OUT1, OUT2, OUT3, OUT4, OUT5, OUT6, OUT7, OUT8, OUT9, OUT10, OUT11, OUT12, OUT13, OUT14, OUT15, OUT16, OUT17, OUT18, OUT19, OUT20, OUT21, OUT22, OUT23, OUT24, OUT25, OUT26, OUT27, OUT28, OUT29, OUT30, OUT31, OUT32, OUT33, OUT34, OUT35, OUT36, OUT37, OUT38, OUT39, OUT40, OUT41, OUT42, OUT43, OUT44, OUT45, OUT46, OUT47, OUT48, OUT49, OUT50, OUT51, OUT52, OUT53, OUT54, OUT55, OUT56, OUT57, OUT58, OUT59, OUT60, OUT61, OUT62, OUT63, OUT64, OUT65, OUT66, OUT67, OUT68, OUT69, OUT70, OUT71, OUT72

### Nets
GND: C8.2 C9.2 C10.2 C22.2 C41.2 C42.2
VLED: C8.1 C9.1 C10.1 C22.1 C41.1 C42.1 LED1.1(Anode) LED2.1(Anode) LED3.1(Anode) LED4.1(Anode) LED5.1(Anode) LED6.1(Anode) LED7.1(Anode) LED8.1(Anode) LED9.1(Anode) LED10.1(Anode) LED11.1(Anode) LED12.1(Anode) LED13.1(Anode) LED14.1(Anode) LED15.1(Anode) LED16.1(Anode) LED17.1(Anode) LED18.1(Anode) LED19.1(Anode) LED20.1(Anode) LED21.1(Anode) LED22.1(Anode) LED23.1(Anode) LED24.1(Anode) LED25.1(Anode)
CATHODE_B: LED14.4(Cathode_Blue) TP99.1 ; port CATHODE_B
CATHODE_G: TP105.1 ; port CATHODE_G
CATHODE_G: LED14.3(Cathode_Green)  [a separate net that carries the same name]
CATHODE_R: LED14.2(Cathode_Red) TP106.1 ; port CATHODE_R
OUT1: LED25.2(Cathode_Red) TP56.1 ; port OUT1
OUT2: LED25.3(Cathode_Green) TP57.1 ; port OUT2
OUT3: LED25.4(Cathode_Blue) TP58.1 ; port OUT3
OUT4: LED2.2(Cathode_Red) TP23.1 ; port OUT4
OUT5: LED2.4(Cathode_Blue) TP25.1 ; port OUT5
OUT6: LED2.3(Cathode_Green) TP24.1 ; port OUT6
OUT7: LED4.2(Cathode_Red) TP26.1 ; port OUT7
OUT8: LED4.3(Cathode_Green) TP27.1 ; port OUT8
OUT9: LED4.4(Cathode_Blue) TP28.1 ; port OUT9
OUT10: LED6.2(Cathode_Red) TP29.1 ; port OUT10
OUT11: LED6.3(Cathode_Green) TP30.1 ; port OUT11
OUT12: LED6.4(Cathode_Blue) TP31.1 ; port OUT12
OUT13: LED8.2(Cathode_Red) TP32.1 ; port OUT13
OUT14: LED8.3(Cathode_Green) TP33.1 ; port OUT14
OUT15: LED8.4(Cathode_Blue) TP34.1 ; port OUT15
OUT16: LED10.2(Cathode_Red) TP35.1 ; port OUT16
OUT17: LED10.3(Cathode_Green) TP36.1 ; port OUT17
OUT18: LED10.4(Cathode_Blue) TP37.1 ; port OUT18
OUT19: LED12.2(Cathode_Red) TP38.1 ; port OUT19
OUT20: LED12.3(Cathode_Green) TP39.1 ; port OUT20
OUT21: LED12.4(Cathode_Blue) TP40.1 ; port OUT21
OUT22: LED15.2(Cathode_Red) TP41.1 ; port OUT22
OUT23: LED15.3(Cathode_Green) TP42.1 ; port OUT23
OUT24: LED15.4(Cathode_Blue) TP43.1 ; port OUT24
OUT25: LED17.2(Cathode_Red) TP44.1 ; port OUT25
OUT26: LED17.3(Cathode_Green) TP45.1 ; port OUT26
OUT27: LED17.4(Cathode_Blue) TP46.1 ; port OUT27
OUT28: LED19.2(Cathode_Red) TP47.1 ; port OUT28
OUT29: LED19.3(Cathode_Green) TP48.1 ; port OUT29
OUT30: LED19.4(Cathode_Blue) TP49.1 ; port OUT30
OUT31: LED21.2(Cathode_Red) TP50.1 ; port OUT31
OUT32: LED21.3(Cathode_Green) TP51.1 ; port OUT32
OUT33: LED21.4(Cathode_Blue) TP52.1 ; port OUT33
OUT34: LED23.4(Cathode_Blue) TP53.1 ; port OUT34
OUT35: LED23.3(Cathode_Green) TP54.1 ; port OUT35
OUT36: LED23.2(Cathode_Red) TP55.1 ; port OUT36
OUT37: LED24.2(Cathode_Red) TP60.1 ; port OUT37
OUT38: LED24.4(Cathode_Blue) TP61.1 ; port OUT38
OUT39: LED24.3(Cathode_Green) TP59.1 ; port OUT39
OUT40: LED22.2(Cathode_Red) TP66.1 ; port OUT40
OUT41: LED22.4(Cathode_Blue) TP68.1 ; port OUT41
OUT42: LED22.3(Cathode_Green) TP67.1 ; port OUT42
OUT43: LED20.2(Cathode_Red) TP71.1 ; port OUT43
OUT44: LED20.4(Cathode_Blue) TP70.1 ; port OUT44
OUT45: LED20.3(Cathode_Green) TP69.1 ; port OUT45
OUT46: LED18.2(Cathode_Red) TP72.1 ; port OUT46
OUT47: LED18.4(Cathode_Blue) TP73.1 ; port OUT47
OUT48: LED18.3(Cathode_Green) TP74.1 ; port OUT48
OUT49: LED16.2(Cathode_Red) TP123.1 ; port OUT49
OUT50: LED16.4(Cathode_Blue) TP124.1 ; port OUT50
OUT51: LED16.3(Cathode_Green) TP122.1 ; port OUT51
OUT52: LED11.2(Cathode_Red) TP119.1 ; port OUT52
OUT53: LED11.4(Cathode_Blue) TP120.1 ; port OUT53
OUT54: LED11.3(Cathode_Green) TP121.1 ; port OUT54
OUT55: LED13.4(Cathode_Blue) TP118.1 ; port OUT55
OUT56: LED13.3(Cathode_Green) TP117.1 ; port OUT56
OUT57: LED13.2(Cathode_Red) TP116.1 ; port OUT57
OUT58: LED9.2(Cathode_Red) TP95.1 ; port OUT58
OUT59: LED9.4(Cathode_Blue) TP93.1 ; port OUT59
OUT60: LED9.3(Cathode_Green) TP94.1 ; port OUT60
OUT61: LED7.2(Cathode_Red) TP92.1 ; port OUT61
OUT62: LED7.4(Cathode_Blue) TP91.1 ; port OUT62
OUT63: LED7.3(Cathode_Green) TP90.1 ; port OUT63
OUT64: LED5.2(Cathode_Red) TP89.1 ; port OUT64
OUT65: LED5.4(Cathode_Blue) TP88.1 ; port OUT65
OUT66: LED5.3(Cathode_Green) TP87.1 ; port OUT66
OUT67: LED3.2(Cathode_Red) TP85.1 ; port OUT67
OUT68: LED3.4(Cathode_Blue) TP84.1 ; port OUT68
OUT69: LED3.3(Cathode_Green) TP83.1 ; port OUT69
OUT70: LED1.2(Cathode_Red) TP82.1 ; port OUT70
OUT71: LED1.4(Cathode_Blue) TP81.1 ; port OUT71
OUT72: LED1.3(Cathode_Green) TP80.1 ; port OUT72

### Notes on the sheet
- Labels drawn without touching a wire or pin: CATHODE_G
- Title
- Size:
- Date:
- B
- Author:
- Time:
- Sheet
- Revision:
- of
- File:

### Library data of the parts
C8-C10 C22 C41 C42 = Varitron_CAP0402: as C33 on sheet 7_ALARM; Tolerance: 10%; Technology: SMT; Temperature Coefficient: X7R; Part Number: CL05B104KO5NNNC; Value: 100 nF; Supplier: Arrow Electronics; Footprint Name: 0402
LED1-LED25 = LTSN-N213EGBW: LED SMD LTSN-N213EGBW; Manufacturer: LiteOn; SmartHalo Part Number: 630029-01; Final: Y; Manufacturer Part Number: LTSN-N213EGBW; Part Number: LTSN-N213EGBW; Footprint Name: CUSTOM(4 pins); Supplier: Arrow Electronics
TP23-TP61 TP66-TP74 TP80-TP85 TP87-TP95 TP99 TP105 TP106 TP116-TP124 = TESTPAD_TH_35mils: as TP126-TP138 on sheet 7_ALARM

## Sheet 0_COVER.SchDoc: SmartHalo V1.0 Rev1 - Cover
size B; Author: Sébastien Gélinas; Organization: CycleLabs Solutions Inc.; Address1: 5445 de Gaspé; Address2: Montréal, QC; Address3: Canada; Address4: H2T 3B2; DocumentNumber: 1; Revision: 1; SheetNumber: 0; SheetTotal: 8
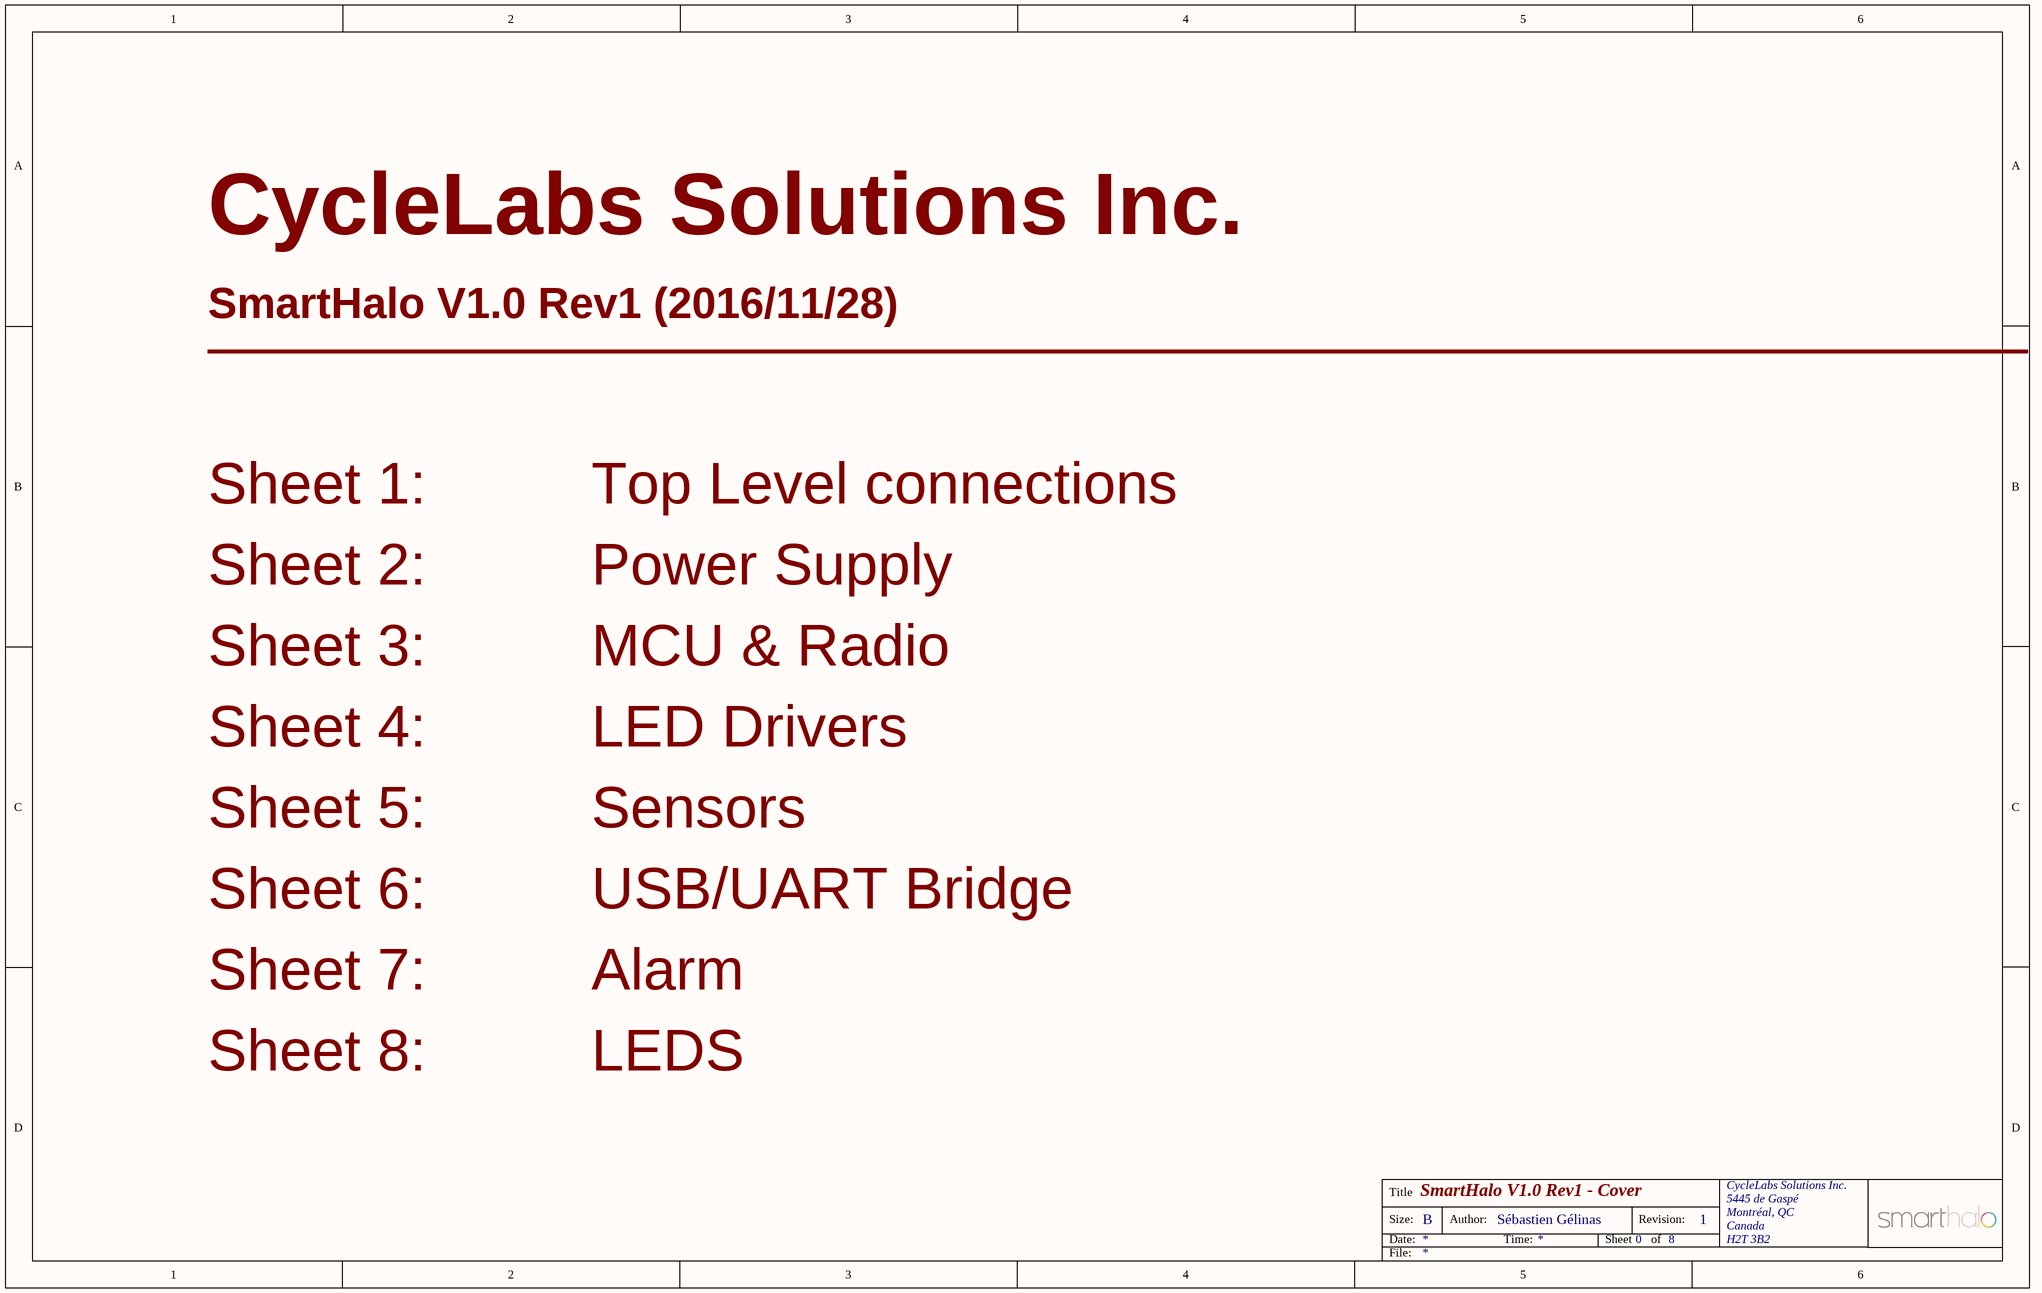
[diagram p8: 0_COVER.SchDoc]

### Notes on the sheet
- CycleLabs Solutions Inc.
- SmartHalo V1.0 Rev1 (2016/11/28)
- ________________________________________________________
- Sheet 1:          Top Level connections
- Sheet 2:          Power Supply
- Sheet 3:          MCU & Radio
- Sheet 4:          LED Drivers
- Sheet 5:          Sensors
- Sheet 6:          USB/UART Bridge
- Sheet 7:          Alarm
- Sheet 8:          LEDS
- Title
- Size:
- Date:
- B
- Author:
- Time:
- Sheet
- Revision:
- of
- File:

## Nets that join several sheets
GND: 2_PWR (37 pins), 3_BLE (28 pins), 4_LEDDRIVERS (20 pins), 5_SENSORS (11 pins), 6_MISC (26 pins), 7_ALARM (14 pins), 8_LEDS (6 pins)
S2V8: 2_PWR (5 pins), 5_SENSORS (C2.1 C3.1 U1.5), 7_ALARM (6 pins)
VBZ: 2_PWR (5 pins), 3_BLE (R35.2), 7_ALARM (5 pins)
VDD_nRF: 2_PWR (8 pins), 3_BLE (13 pins), 5_SENSORS (7 pins), 6_MISC (12 pins)
VLED: 2_PWR (5 pins), 4_LEDDRIVERS (9 pins), 8_LEDS (31 pins)
VUSB: 2_PWR (C23.1 TP19.1 TP20.1 U5.1), 6_MISC (6 pins)
ALARMB: 2_PWR (U14.1), 3_BLE (R30.1 TP163.1 U3.21)
BCD1: 2_PWR (U5.7), 6_MISC (TP148.1 U16.13)
BZR: 3_BLE (U3.4), 7_ALARM (5 pins)
~{CHG}: 2_PWR (U5.8), 3_BLE (R13.2 TP150.1 U3.23)
CATHODE_B: 4_LEDDRIVERS (R14.2), 8_LEDS (LED14.4 TP99.1)
CATHODE_G: 4_LEDDRIVERS (R11.2), 8_LEDS (TP105.1)
CATHODE_R: 4_LEDDRIVERS (R7.2), 8_LEDS (LED14.2 TP106.1)
CENTRAL_B: 3_BLE (U3.40), 4_LEDDRIVERS (Q2.2 TP109.1)
CENTRAL_G: 3_BLE (U3.39), 4_LEDDRIVERS (Q2.5 TP107.1)
CENTRAL_R: 3_BLE (U3.41), 4_LEDDRIVERS (Q1.5 TP108.1)
CTS: 3_BLE (TP147.1 U3.18), 6_MISC (U16.32)
EN_2_8V: 2_PWR (U12.3), 3_BLE (R29.2 TP162.1 U3.28)
EN_VLED: 2_PWR (U15.6), 3_BLE (R31.2 TP160.1 U3.29)
FRONTLED: 3_BLE (U3.5), 4_LEDDRIVERS (TP96.1 U4.1 U6.1)
INT_1_XL: 3_BLE (U3.9), 5_SENSORS (TP64.1 U11.12)
INT_2_XL: 3_BLE (U3.10), 5_SENSORS (TP65.1 U11.11)
INT_MAG: 3_BLE (U3.8), 5_SENSORS (TP75.1 U11.7)
OUT1: 4_LEDDRIVERS (U2.43), 8_LEDS (LED25.2 TP56.1)
OUT2: 4_LEDDRIVERS (U2.44), 8_LEDS (LED25.3 TP57.1)
OUT3: 4_LEDDRIVERS (U2.1), 8_LEDS (LED25.4 TP58.1)
OUT4: 4_LEDDRIVERS (U2.2), 8_LEDS (LED2.2 TP23.1)
OUT5: 4_LEDDRIVERS (U2.3), 8_LEDS (LED2.4 TP25.1)
OUT6: 4_LEDDRIVERS (U2.4), 8_LEDS (LED2.3 TP24.1)
OUT7: 4_LEDDRIVERS (U2.5), 8_LEDS (LED4.2 TP26.1)
OUT8: 4_LEDDRIVERS (U2.6), 8_LEDS (LED4.3 TP27.1)
OUT9: 4_LEDDRIVERS (U2.7), 8_LEDS (LED4.4 TP28.1)
OUT10: 4_LEDDRIVERS (U2.8), 8_LEDS (LED6.2 TP29.1)
OUT11: 4_LEDDRIVERS (U2.9), 8_LEDS (LED6.3 TP30.1)
OUT12: 4_LEDDRIVERS (U2.10), 8_LEDS (LED6.4 TP31.1)
OUT13: 4_LEDDRIVERS (U2.11), 8_LEDS (LED8.2 TP32.1)
OUT14: 4_LEDDRIVERS (U2.12), 8_LEDS (LED8.3 TP33.1)
OUT15: 4_LEDDRIVERS (U2.13), 8_LEDS (LED8.4 TP34.1)
OUT16: 4_LEDDRIVERS (U2.14), 8_LEDS (LED10.2 TP35.1)
OUT17: 4_LEDDRIVERS (U2.15), 8_LEDS (LED10.3 TP36.1)
OUT18: 4_LEDDRIVERS (U2.16), 8_LEDS (LED10.4 TP37.1)
OUT19: 4_LEDDRIVERS (U2.18), 8_LEDS (LED12.2 TP38.1)
OUT20: 4_LEDDRIVERS (U2.19), 8_LEDS (LED12.3 TP39.1)
OUT21: 4_LEDDRIVERS (U2.20), 8_LEDS (LED12.4 TP40.1)
OUT22: 4_LEDDRIVERS (U2.21), 8_LEDS (LED15.2 TP41.1)
OUT23: 4_LEDDRIVERS (U2.22), 8_LEDS (LED15.3 TP42.1)
OUT24: 4_LEDDRIVERS (U2.23), 8_LEDS (LED15.4 TP43.1)
OUT25: 4_LEDDRIVERS (U2.24), 8_LEDS (LED17.2 TP44.1)
OUT26: 4_LEDDRIVERS (U2.25), 8_LEDS (LED17.3 TP45.1)
OUT27: 4_LEDDRIVERS (U2.26), 8_LEDS (LED17.4 TP46.1)
OUT28: 4_LEDDRIVERS (U2.27), 8_LEDS (LED19.2 TP47.1)
OUT29: 4_LEDDRIVERS (U2.28), 8_LEDS (LED19.3 TP48.1)
OUT30: 4_LEDDRIVERS (U2.29), 8_LEDS (LED19.4 TP49.1)
OUT31: 4_LEDDRIVERS (U2.30), 8_LEDS (LED21.2 TP50.1)
OUT32: 4_LEDDRIVERS (U2.31), 8_LEDS (LED21.3 TP51.1)
OUT33: 4_LEDDRIVERS (U2.32), 8_LEDS (LED21.4 TP52.1)
OUT34: 4_LEDDRIVERS (U2.33), 8_LEDS (LED23.4 TP53.1)
OUT35: 4_LEDDRIVERS (U2.34), 8_LEDS (LED23.3 TP54.1)
OUT36: 4_LEDDRIVERS (U2.35), 8_LEDS (LED23.2 TP55.1)
OUT37: 4_LEDDRIVERS (U10.43), 8_LEDS (LED24.2 TP60.1)
OUT38: 4_LEDDRIVERS (U10.44), 8_LEDS (LED24.4 TP61.1)
OUT39: 4_LEDDRIVERS (U10.1), 8_LEDS (LED24.3 TP59.1)
OUT40: 4_LEDDRIVERS (U10.2), 8_LEDS (LED22.2 TP66.1)
OUT41: 4_LEDDRIVERS (U10.3), 8_LEDS (LED22.4 TP68.1)
OUT42: 4_LEDDRIVERS (U10.4), 8_LEDS (LED22.3 TP67.1)
OUT43: 4_LEDDRIVERS (U10.5), 8_LEDS (LED20.2 TP71.1)
OUT44: 4_LEDDRIVERS (U10.6), 8_LEDS (LED20.4 TP70.1)
OUT45: 4_LEDDRIVERS (U10.7), 8_LEDS (LED20.3 TP69.1)
OUT46: 4_LEDDRIVERS (U10.8), 8_LEDS (LED18.2 TP72.1)
OUT47: 4_LEDDRIVERS (U10.9), 8_LEDS (LED18.4 TP73.1)
OUT48: 4_LEDDRIVERS (U10.10), 8_LEDS (LED18.3 TP74.1)
OUT49: 4_LEDDRIVERS (U10.11), 8_LEDS (LED16.2 TP123.1)
OUT50: 4_LEDDRIVERS (U10.12), 8_LEDS (LED16.4 TP124.1)
OUT51: 4_LEDDRIVERS (U10.13), 8_LEDS (LED16.3 TP122.1)
OUT52: 4_LEDDRIVERS (U10.14), 8_LEDS (LED11.2 TP119.1)
OUT53: 4_LEDDRIVERS (U10.15), 8_LEDS (LED11.4 TP120.1)
OUT54: 4_LEDDRIVERS (U10.16), 8_LEDS (LED11.3 TP121.1)
OUT55: 4_LEDDRIVERS (U10.18), 8_LEDS (LED13.4 TP118.1)
OUT56: 4_LEDDRIVERS (U10.19), 8_LEDS (LED13.3 TP117.1)
OUT57: 4_LEDDRIVERS (U10.20), 8_LEDS (LED13.2 TP116.1)
OUT58: 4_LEDDRIVERS (U10.21), 8_LEDS (LED9.2 TP95.1)
OUT59: 4_LEDDRIVERS (U10.22), 8_LEDS (LED9.4 TP93.1)
OUT60: 4_LEDDRIVERS (U10.23), 8_LEDS (LED9.3 TP94.1)
OUT61: 4_LEDDRIVERS (U10.24), 8_LEDS (LED7.2 TP92.1)
OUT62: 4_LEDDRIVERS (U10.25), 8_LEDS (LED7.4 TP91.1)
OUT63: 4_LEDDRIVERS (U10.26), 8_LEDS (LED7.3 TP90.1)
OUT64: 4_LEDDRIVERS (U10.27), 8_LEDS (LED5.2 TP89.1)
OUT65: 4_LEDDRIVERS (U10.28), 8_LEDS (LED5.4 TP88.1)
OUT66: 4_LEDDRIVERS (U10.29), 8_LEDS (LED5.3 TP87.1)
OUT67: 4_LEDDRIVERS (U10.30), 8_LEDS (LED3.2 TP85.1)
OUT68: 4_LEDDRIVERS (U10.31), 8_LEDS (LED3.4 TP84.1)
OUT69: 4_LEDDRIVERS (U10.32), 8_LEDS (LED3.3 TP83.1)
OUT70: 4_LEDDRIVERS (U10.33), 8_LEDS (LED1.2 TP82.1)
OUT71: 4_LEDDRIVERS (U10.34), 8_LEDS (LED1.4 TP81.1)
OUT72: 4_LEDDRIVERS (U10.35), 8_LEDS (LED1.3 TP80.1)
~{PG}: 2_PWR (U5.5), 3_BLE (R10.1 TP149.1 U3.22)
QTOUCH: 3_BLE (R6.1 U3.37), 5_SENSORS (TP100.1 U1.1)
RTS: 3_BLE (TP142.1 U3.15), 6_MISC (U16.8)
RXD: 3_BLE (TP144.1 U3.19), 6_MISC (U16.30)
~{SLEEP}: 3_BLE (TP146.1 U3.14), 6_MISC (U16.9)
SCL: 2_PWR (U14.3), 3_BLE (R20.1 TP63.1 U3.43), 4_LEDDRIVERS (U2.42 U10.42), 5_SENSORS (U11.1)
SDA: 2_PWR (U14.2), 3_BLE (R16.1 TP62.1 U3.42), 4_LEDDRIVERS (U2.41 U10.41), 5_SENSORS (U11.4)
SDB: 3_BLE (R17.2 TP115.1 U3.6), 4_LEDDRIVERS (U2.36 U10.36)
SYNC/MODE: 3_BLE (U3.38), 5_SENSORS (TP101.1 U1.6)
TS: 2_PWR (RT1.2 TP111.1 U5.9), 6_MISC (Q1.6)
TXD: 3_BLE (TP145.1 U3.17), 6_MISC (U16.2)
~{USBRESET}: 3_BLE (J7.3 TP78.1 U3.24), 6_MISC (U20.4)
VBZ_EN: 2_PWR (U7.5), 3_BLE (R28.1 TP161.1 U3.27)
~{WAKEUP}: 3_BLE (TP143.1 U3.16), 6_MISC (U16.3)